# EasyEDA schematic USBA_SCH.json
TITLE: Sheet_1; REV: 1.0; Date: 2022-03-01; Sheet: 1/1; Drawn By: Anthony Tricarichi; Company: Your Company
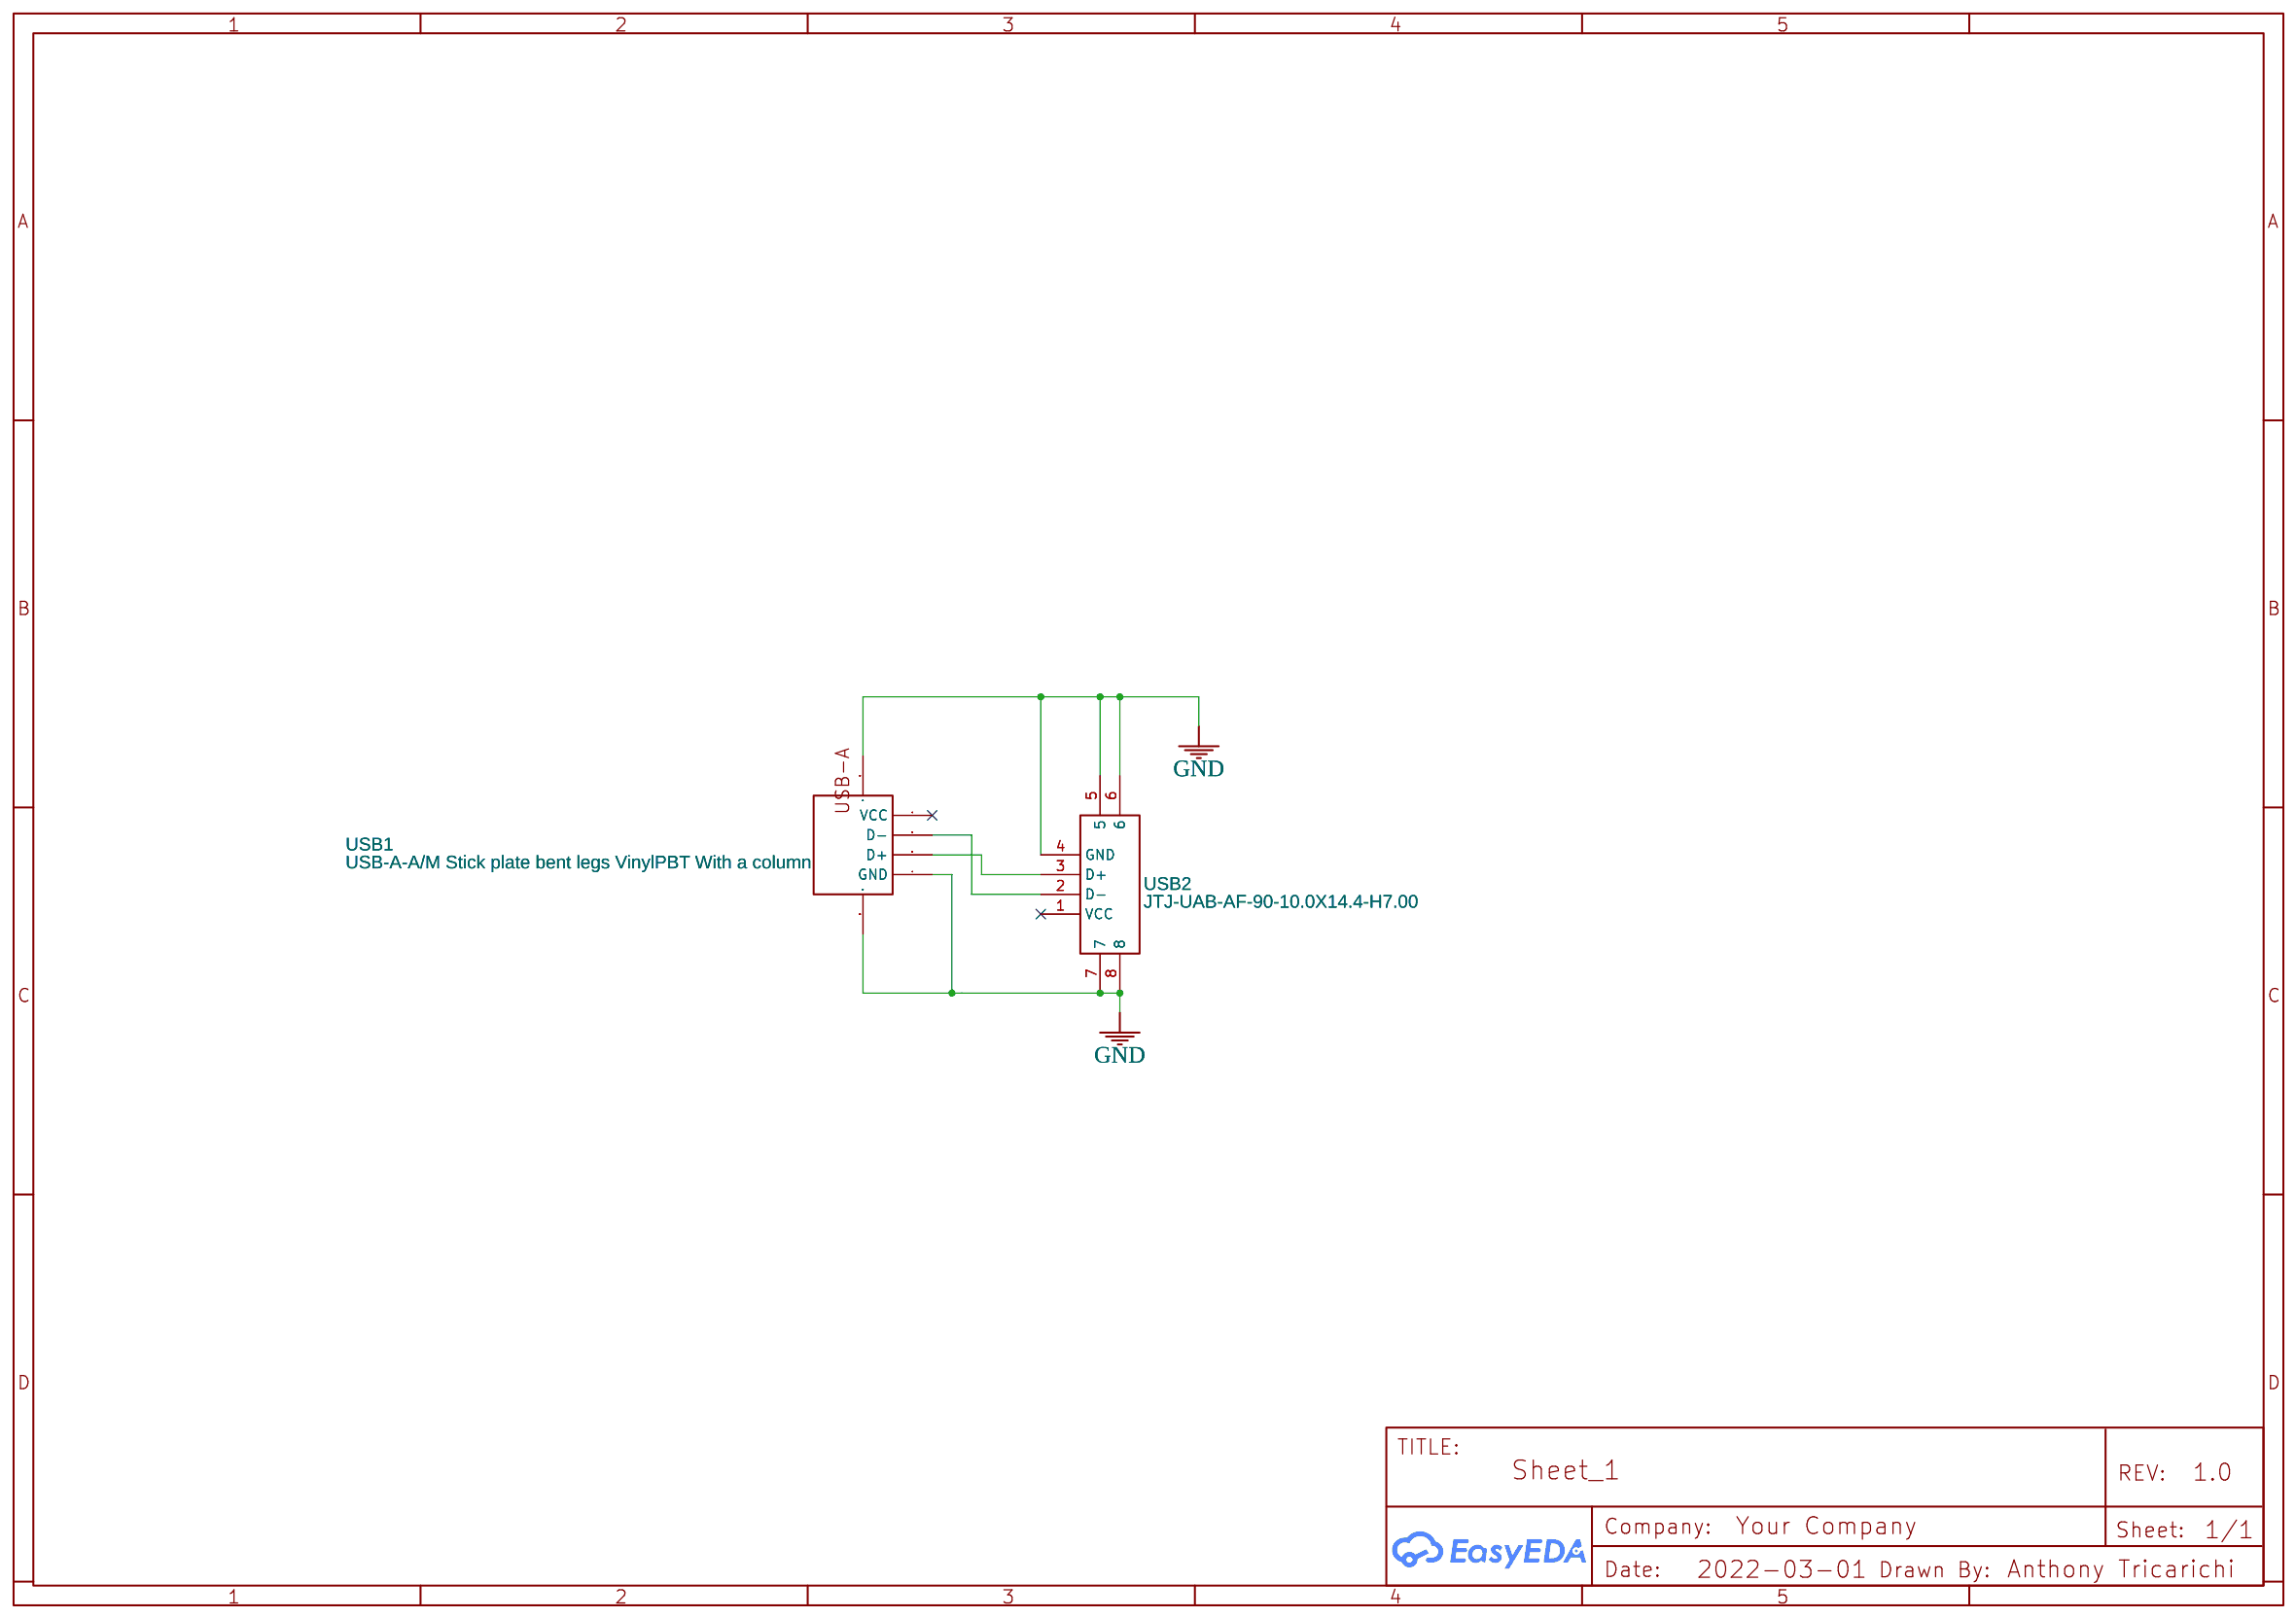
[diagram p0: schematic sheet]

## Parts
USB1  USB-A-A/M Stick plate bent legs VinylPBT With a column  [USB-A-SMD_USB-A-1-TH]
USB2  JTJ-UAB-AF-90-10.0X14.4-H7.00  [USB-A-SMD_C42591]

## Library data of the parts
USB1 = USB-A-A/M Stick plate bent legs VinylPBT With a column: Supplier: LCSC; Manufacturer: ValuePro; Manufacturer Part: A/M Stick plate bent legs VinylPBT With a column; Supplier Part: C46394; JLCPCB Part Class: Extended Part
USB2 = JTJ-UAB-AF-90-10.0X14.4-H7.00: Supplier: LCSC; Supplier Part: C42591; Manufacturer: LCSC; Contributor: LCSC; JLCPCB Part Class: Extended Part

## Nets
GND: USB1.4(GND) USB1.5 USB1.6 USB2.4(GND) USB2.5 USB2.6 USB2.7 USB2.8
Net-(USB1-2): USB1.2(D-) USB2.2(D-)
Net-(USB1-3): USB1.3(D+) USB2.3(D+)

Not connected (* = marked no-connect by the designer): USB1 1(VCC)*; USB2 1(VCC)*
